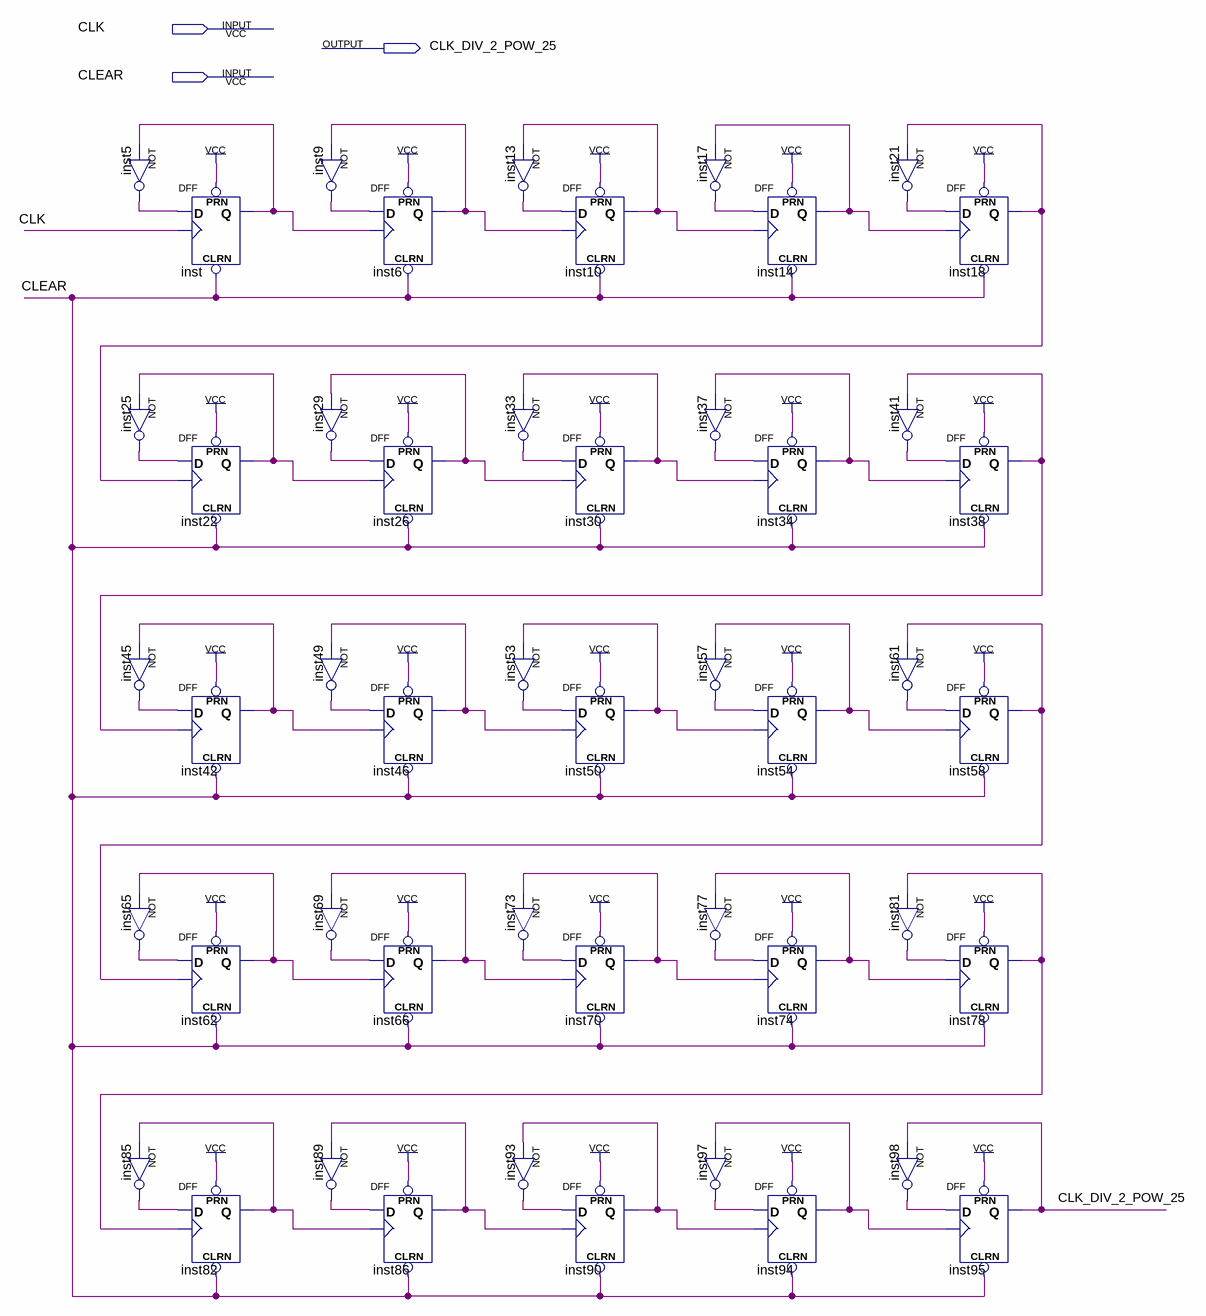
[diagram p0: schematic sheet]
// Quartus schematic FREQUENCY_DIVIDER.bdf as structural Verilog: 50 symbols, 3 pins
module FREQUENCY_DIVIDER (
  input  CLK,
  input  CLEAR,
  output CLK_DIV_2_POW_25
);

  wire inst5_out, inst6_q, inst9_out, inst10_q, inst13_out, inst14_q, inst17_out, inst18_q, inst21_out,
       inst22_q, inst25_out, inst26_q, inst29_out, inst30_q, inst33_out, inst34_q, inst37_out, inst38_q,
       inst41_out, inst42_q, inst45_out, inst46_q, inst49_out, inst50_q, inst53_out, inst54_q, inst57_out,
       inst58_q, inst61_out, inst62_q, inst65_out, inst66_q, inst69_out, inst70_q, inst73_out, inst74_q,
       inst77_out, inst78_q, inst81_out, inst82_q, inst85_out, inst86_q, inst89_out, inst90_q, inst93_out,
       inst94_q, inst97_out, inst98_out, inst_q;

  not inst5 (inst5_out, inst_q);
  DFF inst (.CLRN(CLEAR), .CLK(CLK), .D(inst5_out), .PRN(1'b1), .Q(inst_q));
  not inst25 (inst25_out, inst22_q);
  DFF inst22 (.CLRN(CLEAR), .CLK(inst18_q), .D(inst25_out), .PRN(1'b1), .Q(inst22_q));
  not inst45 (inst45_out, inst42_q);
  DFF inst42 (.CLRN(CLEAR), .CLK(inst38_q), .D(inst45_out), .PRN(1'b1), .Q(inst42_q));
  not inst65 (inst65_out, inst62_q);
  DFF inst62 (.CLRN(CLEAR), .CLK(inst58_q), .D(inst65_out), .PRN(1'b1), .Q(inst62_q));
  not inst85 (inst85_out, inst82_q);
  DFF inst82 (.CLRN(CLEAR), .CLK(inst78_q), .D(inst85_out), .PRN(1'b1), .Q(inst82_q));
  not inst9 (inst9_out, inst6_q);
  not inst29 (inst29_out, inst26_q);
  not inst49 (inst49_out, inst46_q);
  not inst69 (inst69_out, inst66_q);
  not inst89 (inst89_out, inst86_q);
  DFF inst6 (.CLRN(CLEAR), .CLK(inst_q), .D(inst9_out), .PRN(1'b1), .Q(inst6_q));
  DFF inst26 (.CLRN(CLEAR), .CLK(inst22_q), .D(inst29_out), .PRN(1'b1), .Q(inst26_q));
  DFF inst46 (.CLRN(CLEAR), .CLK(inst42_q), .D(inst49_out), .PRN(1'b1), .Q(inst46_q));
  DFF inst66 (.CLRN(CLEAR), .CLK(inst62_q), .D(inst69_out), .PRN(1'b1), .Q(inst66_q));
  DFF inst86 (.CLRN(CLEAR), .CLK(inst82_q), .D(inst89_out), .PRN(1'b1), .Q(inst86_q));
  not inst13 (inst13_out, inst10_q);
  DFF inst10 (.CLRN(CLEAR), .CLK(inst6_q), .D(inst13_out), .PRN(1'b1), .Q(inst10_q));
  not inst33 (inst33_out, inst30_q);
  DFF inst30 (.CLRN(CLEAR), .CLK(inst26_q), .D(inst33_out), .PRN(1'b1), .Q(inst30_q));
  not inst53 (inst53_out, inst50_q);
  DFF inst50 (.CLRN(CLEAR), .CLK(inst46_q), .D(inst53_out), .PRN(1'b1), .Q(inst50_q));
  not inst73 (inst73_out, inst70_q);
  DFF inst70 (.CLRN(CLEAR), .CLK(inst66_q), .D(inst73_out), .PRN(1'b1), .Q(inst70_q));
  not inst93 (inst93_out, inst90_q);
  DFF inst90 (.CLRN(CLEAR), .CLK(inst86_q), .D(inst93_out), .PRN(1'b1), .Q(inst90_q));
  not inst17 (inst17_out, inst14_q);
  not inst37 (inst37_out, inst34_q);
  not inst57 (inst57_out, inst54_q);
  not inst77 (inst77_out, inst74_q);
  not inst97 (inst97_out, inst94_q);
  DFF inst14 (.CLRN(CLEAR), .CLK(inst10_q), .D(inst17_out), .PRN(1'b1), .Q(inst14_q));
  DFF inst34 (.CLRN(CLEAR), .CLK(inst30_q), .D(inst37_out), .PRN(1'b1), .Q(inst34_q));
  DFF inst54 (.CLRN(CLEAR), .CLK(inst50_q), .D(inst57_out), .PRN(1'b1), .Q(inst54_q));
  DFF inst74 (.CLRN(CLEAR), .CLK(inst70_q), .D(inst77_out), .PRN(1'b1), .Q(inst74_q));
  DFF inst94 (.CLRN(CLEAR), .CLK(inst90_q), .D(inst97_out), .PRN(1'b1), .Q(inst94_q));
  not inst21 (inst21_out, inst18_q);
  DFF inst18 (.CLRN(CLEAR), .CLK(inst14_q), .D(inst21_out), .PRN(1'b1), .Q(inst18_q));
  not inst41 (inst41_out, inst38_q);
  DFF inst38 (.CLRN(CLEAR), .CLK(inst34_q), .D(inst41_out), .PRN(1'b1), .Q(inst38_q));
  not inst61 (inst61_out, inst58_q);
  DFF inst58 (.CLRN(CLEAR), .CLK(inst54_q), .D(inst61_out), .PRN(1'b1), .Q(inst58_q));
  not inst81 (inst81_out, inst78_q);
  DFF inst78 (.CLRN(CLEAR), .CLK(inst74_q), .D(inst81_out), .PRN(1'b1), .Q(inst78_q));
  not inst98 (inst98_out, CLK_DIV_2_POW_25);
  DFF inst95 (.CLRN(CLEAR), .CLK(inst94_q), .D(inst98_out), .PRN(1'b1), .Q(CLK_DIV_2_POW_25));
endmodule
